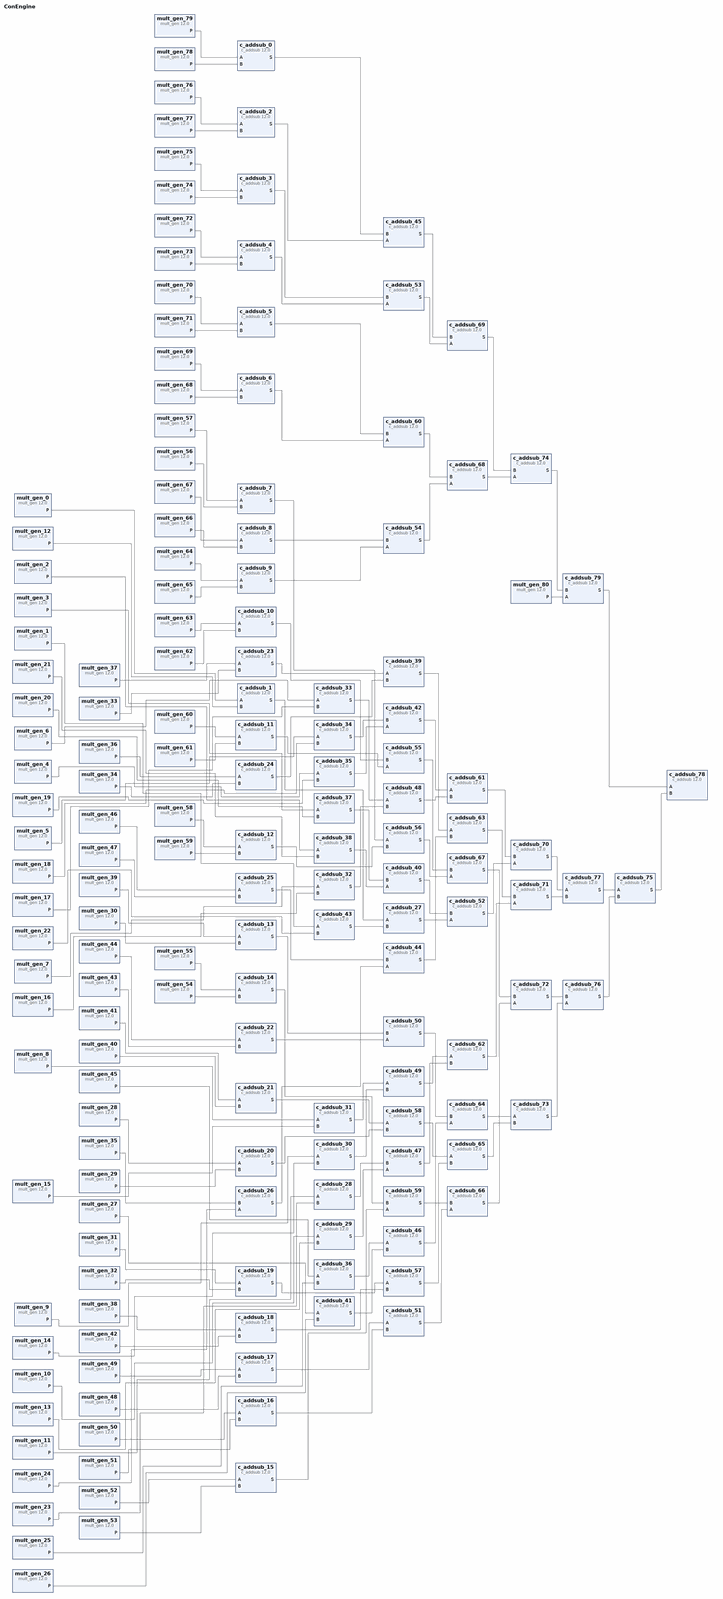
[diagram p0: block diagram of the top level, whole]
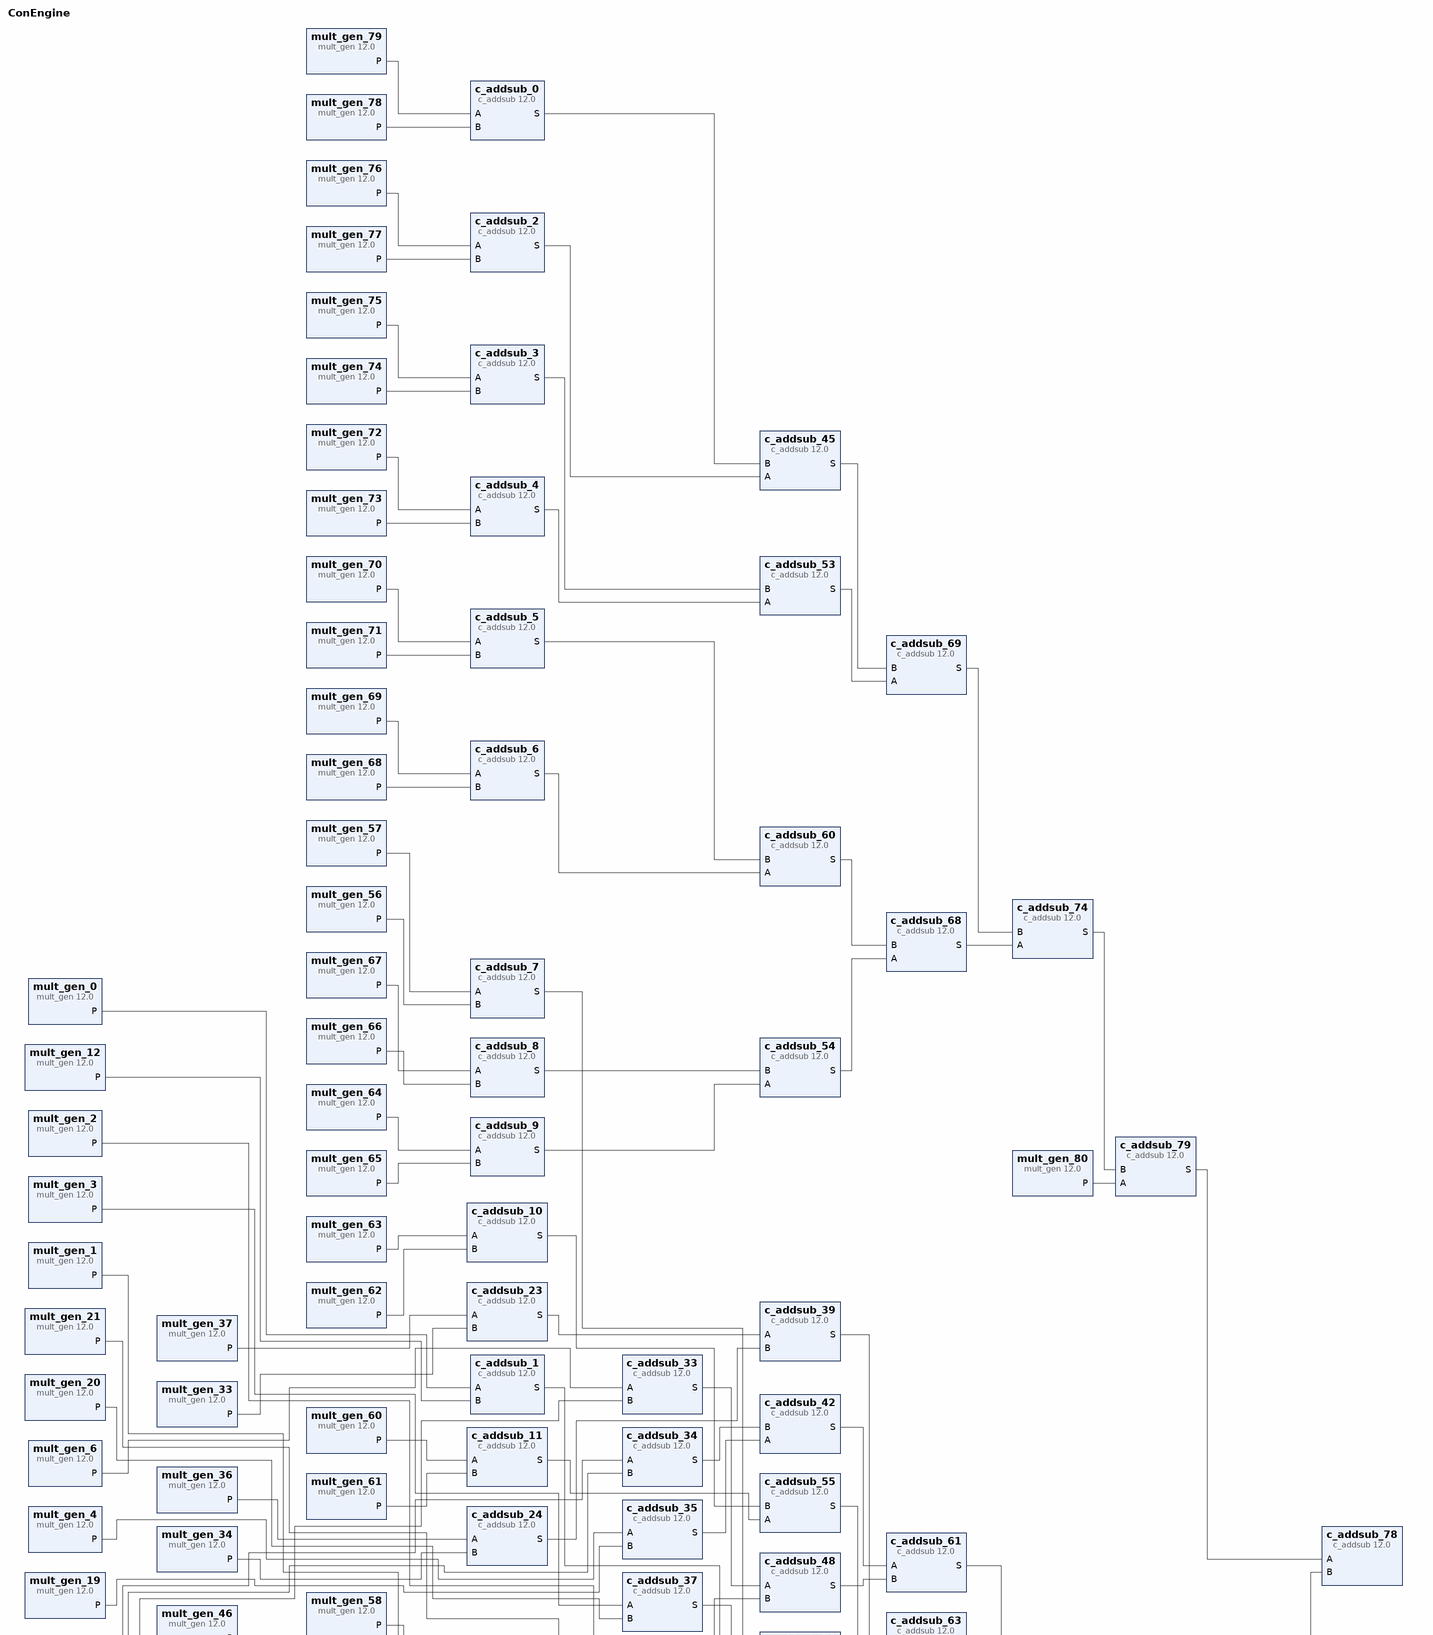
[diagram p1: block diagram of the top level, upper part]
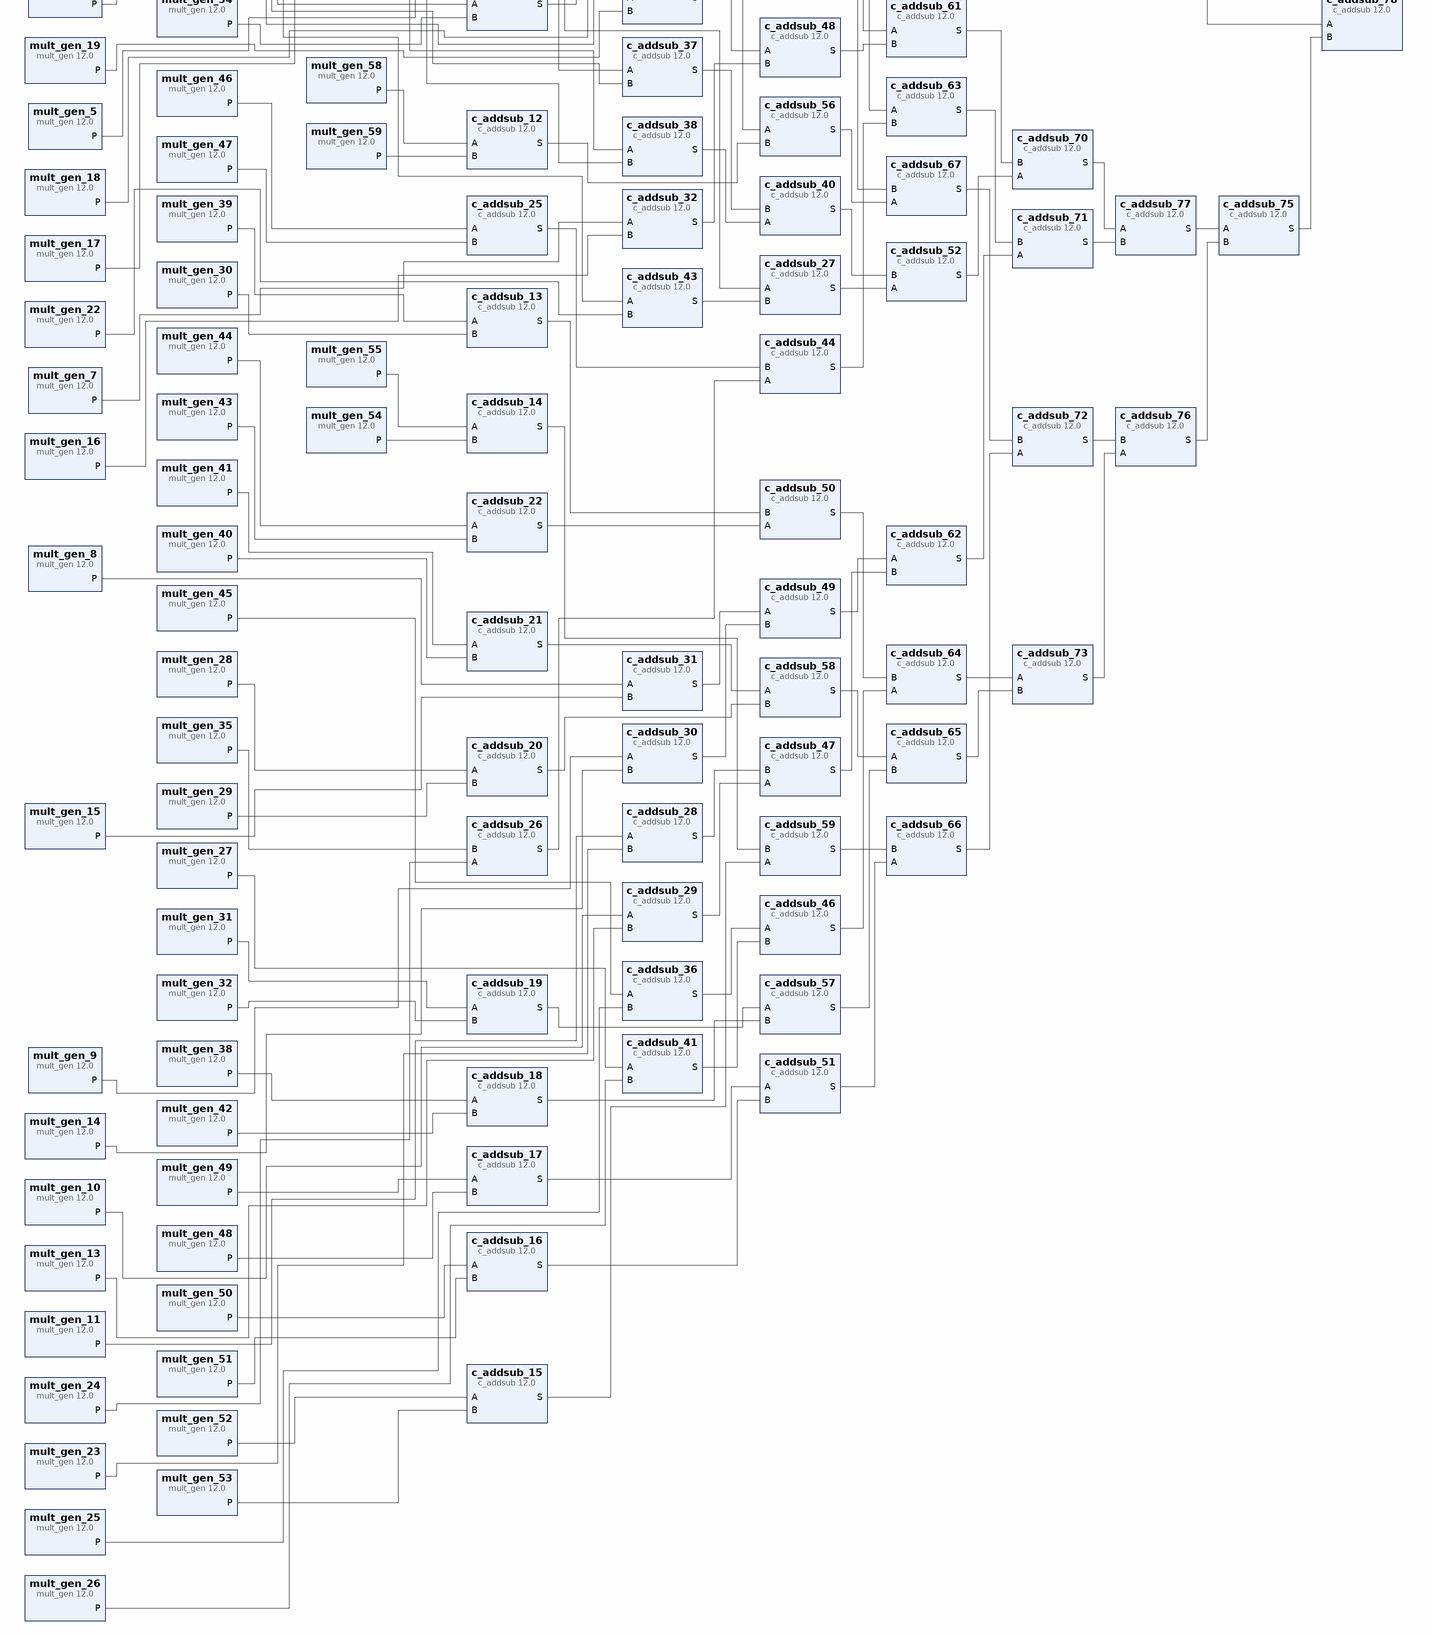
[diagram p2: block diagram of the top level, lower part]
# Vivado block design ConEngine, Vivado 2016.2
create_bd_design ConEngine

create_bd_cell -type ip -vlnv xilinx.com:ip:mult_gen:12.0 mult_gen_0
set_property -dict {CONFIG.PortAWidth 8 CONFIG.PortBWidth 8 CONFIG.Multiplier_Construction Use_Mults} [get_bd_cells mult_gen_0]
create_bd_cell -type ip -vlnv xilinx.com:ip:mult_gen:12.0 mult_gen_1
set_property -dict {CONFIG.PortAWidth 8 CONFIG.PortBWidth 8 CONFIG.Multiplier_Construction Use_Mults} [get_bd_cells mult_gen_1]
create_bd_cell -type ip -vlnv xilinx.com:ip:mult_gen:12.0 mult_gen_2
set_property -dict {CONFIG.PortAWidth 8 CONFIG.PortBWidth 8 CONFIG.Multiplier_Construction Use_Mults} [get_bd_cells mult_gen_2]
create_bd_cell -type ip -vlnv xilinx.com:ip:mult_gen:12.0 mult_gen_3
set_property -dict {CONFIG.PortAWidth 8 CONFIG.PortBWidth 8 CONFIG.Multiplier_Construction Use_Mults} [get_bd_cells mult_gen_3]
create_bd_cell -type ip -vlnv xilinx.com:ip:mult_gen:12.0 mult_gen_4
set_property -dict {CONFIG.PortAWidth 8 CONFIG.PortBWidth 8 CONFIG.Multiplier_Construction Use_Mults} [get_bd_cells mult_gen_4]
create_bd_cell -type ip -vlnv xilinx.com:ip:mult_gen:12.0 mult_gen_5
set_property -dict {CONFIG.PortAWidth 8 CONFIG.PortBWidth 8 CONFIG.Multiplier_Construction Use_Mults} [get_bd_cells mult_gen_5]
create_bd_cell -type ip -vlnv xilinx.com:ip:mult_gen:12.0 mult_gen_6
set_property -dict {CONFIG.PortAWidth 8 CONFIG.PortBWidth 8 CONFIG.Multiplier_Construction Use_Mults} [get_bd_cells mult_gen_6]
create_bd_cell -type ip -vlnv xilinx.com:ip:mult_gen:12.0 mult_gen_7
set_property -dict {CONFIG.PortAWidth 8 CONFIG.PortBWidth 8 CONFIG.Multiplier_Construction Use_Mults} [get_bd_cells mult_gen_7]
create_bd_cell -type ip -vlnv xilinx.com:ip:mult_gen:12.0 mult_gen_8
set_property -dict {CONFIG.PortAWidth 8 CONFIG.PortBWidth 8 CONFIG.Multiplier_Construction Use_Mults} [get_bd_cells mult_gen_8]
create_bd_cell -type ip -vlnv xilinx.com:ip:mult_gen:12.0 mult_gen_9
set_property -dict {CONFIG.PortAWidth 8 CONFIG.PortBWidth 8 CONFIG.Multiplier_Construction Use_Mults} [get_bd_cells mult_gen_9]
create_bd_cell -type ip -vlnv xilinx.com:ip:mult_gen:12.0 mult_gen_10
set_property -dict {CONFIG.PortAWidth 8 CONFIG.PortBWidth 8 CONFIG.Multiplier_Construction Use_Mults} [get_bd_cells mult_gen_10]
create_bd_cell -type ip -vlnv xilinx.com:ip:mult_gen:12.0 mult_gen_11
set_property -dict {CONFIG.PortAWidth 8 CONFIG.PortBWidth 8 CONFIG.Multiplier_Construction Use_Mults} [get_bd_cells mult_gen_11]
create_bd_cell -type ip -vlnv xilinx.com:ip:mult_gen:12.0 mult_gen_12
set_property -dict {CONFIG.PortAWidth 8 CONFIG.PortBWidth 8 CONFIG.Multiplier_Construction Use_Mults} [get_bd_cells mult_gen_12]
create_bd_cell -type ip -vlnv xilinx.com:ip:mult_gen:12.0 mult_gen_13
set_property -dict {CONFIG.PortAWidth 8 CONFIG.PortBWidth 8 CONFIG.Multiplier_Construction Use_Mults} [get_bd_cells mult_gen_13]
create_bd_cell -type ip -vlnv xilinx.com:ip:mult_gen:12.0 mult_gen_14
set_property -dict {CONFIG.PortAWidth 8 CONFIG.PortBWidth 8 CONFIG.Multiplier_Construction Use_Mults} [get_bd_cells mult_gen_14]
create_bd_cell -type ip -vlnv xilinx.com:ip:mult_gen:12.0 mult_gen_15
set_property -dict {CONFIG.PortAWidth 8 CONFIG.PortBWidth 8 CONFIG.Multiplier_Construction Use_Mults} [get_bd_cells mult_gen_15]
create_bd_cell -type ip -vlnv xilinx.com:ip:mult_gen:12.0 mult_gen_16
set_property -dict {CONFIG.PortAWidth 8 CONFIG.PortBWidth 8 CONFIG.Multiplier_Construction Use_Mults} [get_bd_cells mult_gen_16]
create_bd_cell -type ip -vlnv xilinx.com:ip:mult_gen:12.0 mult_gen_17
set_property -dict {CONFIG.PortAWidth 8 CONFIG.PortBWidth 8 CONFIG.Multiplier_Construction Use_Mults} [get_bd_cells mult_gen_17]
create_bd_cell -type ip -vlnv xilinx.com:ip:mult_gen:12.0 mult_gen_18
set_property -dict {CONFIG.PortAWidth 8 CONFIG.PortBWidth 8 CONFIG.Multiplier_Construction Use_Mults} [get_bd_cells mult_gen_18]
create_bd_cell -type ip -vlnv xilinx.com:ip:mult_gen:12.0 mult_gen_19
set_property -dict {CONFIG.PortAWidth 8 CONFIG.PortBWidth 8 CONFIG.Multiplier_Construction Use_Mults} [get_bd_cells mult_gen_19]
create_bd_cell -type ip -vlnv xilinx.com:ip:mult_gen:12.0 mult_gen_20
set_property -dict {CONFIG.PortAWidth 8 CONFIG.PortBWidth 8 CONFIG.Multiplier_Construction Use_Mults} [get_bd_cells mult_gen_20]
create_bd_cell -type ip -vlnv xilinx.com:ip:mult_gen:12.0 mult_gen_21
set_property -dict {CONFIG.PortAWidth 8 CONFIG.PortBWidth 8 CONFIG.Multiplier_Construction Use_Mults} [get_bd_cells mult_gen_21]
create_bd_cell -type ip -vlnv xilinx.com:ip:mult_gen:12.0 mult_gen_22
set_property -dict {CONFIG.PortAWidth 8 CONFIG.PortBWidth 8 CONFIG.Multiplier_Construction Use_Mults} [get_bd_cells mult_gen_22]
create_bd_cell -type ip -vlnv xilinx.com:ip:mult_gen:12.0 mult_gen_23
set_property -dict {CONFIG.PortAWidth 8 CONFIG.PortBWidth 8 CONFIG.Multiplier_Construction Use_Mults} [get_bd_cells mult_gen_23]
create_bd_cell -type ip -vlnv xilinx.com:ip:mult_gen:12.0 mult_gen_24
set_property -dict {CONFIG.PortAWidth 8 CONFIG.PortBWidth 8 CONFIG.Multiplier_Construction Use_Mults} [get_bd_cells mult_gen_24]
create_bd_cell -type ip -vlnv xilinx.com:ip:mult_gen:12.0 mult_gen_25
set_property -dict {CONFIG.PortAWidth 8 CONFIG.PortBWidth 8 CONFIG.Multiplier_Construction Use_Mults} [get_bd_cells mult_gen_25]
create_bd_cell -type ip -vlnv xilinx.com:ip:mult_gen:12.0 mult_gen_26
set_property -dict {CONFIG.PortAWidth 8 CONFIG.PortBWidth 8 CONFIG.Multiplier_Construction Use_Mults} [get_bd_cells mult_gen_26]
create_bd_cell -type ip -vlnv xilinx.com:ip:mult_gen:12.0 mult_gen_27
set_property -dict {CONFIG.PortAWidth 8 CONFIG.PortBWidth 8 CONFIG.Multiplier_Construction Use_Mults} [get_bd_cells mult_gen_27]
create_bd_cell -type ip -vlnv xilinx.com:ip:mult_gen:12.0 mult_gen_28
set_property -dict {CONFIG.PortAWidth 8 CONFIG.PortBWidth 8 CONFIG.Multiplier_Construction Use_Mults} [get_bd_cells mult_gen_28]
create_bd_cell -type ip -vlnv xilinx.com:ip:mult_gen:12.0 mult_gen_29
set_property -dict {CONFIG.PortAWidth 8 CONFIG.PortBWidth 8 CONFIG.Multiplier_Construction Use_Mults} [get_bd_cells mult_gen_29]
create_bd_cell -type ip -vlnv xilinx.com:ip:mult_gen:12.0 mult_gen_30
set_property -dict {CONFIG.PortAWidth 8 CONFIG.PortBWidth 8 CONFIG.Multiplier_Construction Use_Mults} [get_bd_cells mult_gen_30]
create_bd_cell -type ip -vlnv xilinx.com:ip:mult_gen:12.0 mult_gen_31
set_property -dict {CONFIG.PortAWidth 8 CONFIG.PortBWidth 8 CONFIG.Multiplier_Construction Use_Mults} [get_bd_cells mult_gen_31]
create_bd_cell -type ip -vlnv xilinx.com:ip:mult_gen:12.0 mult_gen_32
set_property -dict {CONFIG.PortAWidth 8 CONFIG.PortBWidth 8 CONFIG.Multiplier_Construction Use_Mults} [get_bd_cells mult_gen_32]
create_bd_cell -type ip -vlnv xilinx.com:ip:mult_gen:12.0 mult_gen_33
set_property -dict {CONFIG.PortAWidth 8 CONFIG.PortBWidth 8 CONFIG.Multiplier_Construction Use_Mults} [get_bd_cells mult_gen_33]
create_bd_cell -type ip -vlnv xilinx.com:ip:mult_gen:12.0 mult_gen_34
set_property -dict {CONFIG.PortAWidth 8 CONFIG.PortBWidth 8 CONFIG.Multiplier_Construction Use_Mults} [get_bd_cells mult_gen_34]
create_bd_cell -type ip -vlnv xilinx.com:ip:mult_gen:12.0 mult_gen_35
set_property -dict {CONFIG.PortAWidth 8 CONFIG.PortBWidth 8 CONFIG.Multiplier_Construction Use_Mults} [get_bd_cells mult_gen_35]
create_bd_cell -type ip -vlnv xilinx.com:ip:mult_gen:12.0 mult_gen_36
set_property -dict {CONFIG.PortAWidth 8 CONFIG.PortBWidth 8 CONFIG.Multiplier_Construction Use_Mults} [get_bd_cells mult_gen_36]
create_bd_cell -type ip -vlnv xilinx.com:ip:mult_gen:12.0 mult_gen_37
set_property -dict {CONFIG.PortAWidth 8 CONFIG.PortBWidth 8 CONFIG.Multiplier_Construction Use_Mults} [get_bd_cells mult_gen_37]
create_bd_cell -type ip -vlnv xilinx.com:ip:mult_gen:12.0 mult_gen_38
set_property -dict {CONFIG.PortAWidth 8 CONFIG.PortBWidth 8 CONFIG.Multiplier_Construction Use_Mults} [get_bd_cells mult_gen_38]
create_bd_cell -type ip -vlnv xilinx.com:ip:mult_gen:12.0 mult_gen_39
set_property -dict {CONFIG.PortAWidth 8 CONFIG.PortBWidth 8 CONFIG.Multiplier_Construction Use_Mults} [get_bd_cells mult_gen_39]
create_bd_cell -type ip -vlnv xilinx.com:ip:mult_gen:12.0 mult_gen_40
set_property -dict {CONFIG.PortAWidth 8 CONFIG.PortBWidth 8 CONFIG.Multiplier_Construction Use_Mults} [get_bd_cells mult_gen_40]
create_bd_cell -type ip -vlnv xilinx.com:ip:mult_gen:12.0 mult_gen_41
set_property -dict {CONFIG.PortAWidth 8 CONFIG.PortBWidth 8 CONFIG.Multiplier_Construction Use_Mults} [get_bd_cells mult_gen_41]
create_bd_cell -type ip -vlnv xilinx.com:ip:mult_gen:12.0 mult_gen_42
set_property -dict {CONFIG.PortAWidth 8 CONFIG.PortBWidth 8 CONFIG.Multiplier_Construction Use_Mults} [get_bd_cells mult_gen_42]
create_bd_cell -type ip -vlnv xilinx.com:ip:mult_gen:12.0 mult_gen_43
set_property -dict {CONFIG.PortAWidth 8 CONFIG.PortBWidth 8 CONFIG.Multiplier_Construction Use_Mults} [get_bd_cells mult_gen_43]
create_bd_cell -type ip -vlnv xilinx.com:ip:mult_gen:12.0 mult_gen_44
set_property -dict {CONFIG.PortAWidth 8 CONFIG.PortBWidth 8 CONFIG.Multiplier_Construction Use_Mults} [get_bd_cells mult_gen_44]
create_bd_cell -type ip -vlnv xilinx.com:ip:mult_gen:12.0 mult_gen_45
set_property -dict {CONFIG.PortAWidth 8 CONFIG.PortBWidth 8 CONFIG.Multiplier_Construction Use_Mults} [get_bd_cells mult_gen_45]
create_bd_cell -type ip -vlnv xilinx.com:ip:mult_gen:12.0 mult_gen_46
set_property -dict {CONFIG.PortAWidth 8 CONFIG.PortBWidth 8 CONFIG.Multiplier_Construction Use_Mults} [get_bd_cells mult_gen_46]
create_bd_cell -type ip -vlnv xilinx.com:ip:mult_gen:12.0 mult_gen_47
set_property -dict {CONFIG.PortAWidth 8 CONFIG.PortBWidth 8 CONFIG.Multiplier_Construction Use_Mults} [get_bd_cells mult_gen_47]
create_bd_cell -type ip -vlnv xilinx.com:ip:mult_gen:12.0 mult_gen_48
set_property -dict {CONFIG.PortAWidth 8 CONFIG.PortBWidth 8 CONFIG.Multiplier_Construction Use_Mults} [get_bd_cells mult_gen_48]
create_bd_cell -type ip -vlnv xilinx.com:ip:mult_gen:12.0 mult_gen_49
set_property -dict {CONFIG.PortAWidth 8 CONFIG.PortBWidth 8 CONFIG.Multiplier_Construction Use_Mults} [get_bd_cells mult_gen_49]
create_bd_cell -type ip -vlnv xilinx.com:ip:mult_gen:12.0 mult_gen_50
set_property -dict {CONFIG.PortAWidth 8 CONFIG.PortBWidth 8 CONFIG.Multiplier_Construction Use_Mults} [get_bd_cells mult_gen_50]
create_bd_cell -type ip -vlnv xilinx.com:ip:mult_gen:12.0 mult_gen_51
set_property -dict {CONFIG.PortAWidth 8 CONFIG.PortBWidth 8 CONFIG.Multiplier_Construction Use_Mults} [get_bd_cells mult_gen_51]
create_bd_cell -type ip -vlnv xilinx.com:ip:mult_gen:12.0 mult_gen_52
set_property -dict {CONFIG.PortAWidth 8 CONFIG.PortBWidth 8 CONFIG.Multiplier_Construction Use_Mults} [get_bd_cells mult_gen_52]
create_bd_cell -type ip -vlnv xilinx.com:ip:mult_gen:12.0 mult_gen_53
set_property -dict {CONFIG.PortAWidth 8 CONFIG.PortBWidth 8 CONFIG.Multiplier_Construction Use_Mults} [get_bd_cells mult_gen_53]
create_bd_cell -type ip -vlnv xilinx.com:ip:mult_gen:12.0 mult_gen_54
set_property -dict {CONFIG.PortAWidth 8 CONFIG.PortBWidth 8 CONFIG.Multiplier_Construction Use_Mults} [get_bd_cells mult_gen_54]
create_bd_cell -type ip -vlnv xilinx.com:ip:mult_gen:12.0 mult_gen_55
set_property -dict {CONFIG.PortAWidth 8 CONFIG.PortBWidth 8 CONFIG.Multiplier_Construction Use_Mults} [get_bd_cells mult_gen_55]
create_bd_cell -type ip -vlnv xilinx.com:ip:mult_gen:12.0 mult_gen_56
set_property -dict {CONFIG.PortAWidth 8 CONFIG.PortBWidth 8 CONFIG.Multiplier_Construction Use_Mults} [get_bd_cells mult_gen_56]
create_bd_cell -type ip -vlnv xilinx.com:ip:mult_gen:12.0 mult_gen_57
set_property -dict {CONFIG.PortAWidth 8 CONFIG.PortBWidth 8 CONFIG.Multiplier_Construction Use_Mults} [get_bd_cells mult_gen_57]
create_bd_cell -type ip -vlnv xilinx.com:ip:mult_gen:12.0 mult_gen_58
set_property -dict {CONFIG.PortAWidth 8 CONFIG.PortBWidth 8 CONFIG.Multiplier_Construction Use_Mults} [get_bd_cells mult_gen_58]
create_bd_cell -type ip -vlnv xilinx.com:ip:mult_gen:12.0 mult_gen_59
set_property -dict {CONFIG.PortAWidth 8 CONFIG.PortBWidth 8 CONFIG.Multiplier_Construction Use_Mults} [get_bd_cells mult_gen_59]
create_bd_cell -type ip -vlnv xilinx.com:ip:mult_gen:12.0 mult_gen_60
set_property -dict {CONFIG.PortAWidth 8 CONFIG.PortBWidth 8 CONFIG.Multiplier_Construction Use_Mults} [get_bd_cells mult_gen_60]
create_bd_cell -type ip -vlnv xilinx.com:ip:mult_gen:12.0 mult_gen_61
set_property -dict {CONFIG.PortAWidth 8 CONFIG.PortBWidth 8 CONFIG.Multiplier_Construction Use_Mults} [get_bd_cells mult_gen_61]
create_bd_cell -type ip -vlnv xilinx.com:ip:mult_gen:12.0 mult_gen_62
set_property -dict {CONFIG.PortAWidth 8 CONFIG.PortBWidth 8 CONFIG.Multiplier_Construction Use_Mults} [get_bd_cells mult_gen_62]
create_bd_cell -type ip -vlnv xilinx.com:ip:mult_gen:12.0 mult_gen_63
set_property -dict {CONFIG.PortAWidth 8 CONFIG.PortBWidth 8 CONFIG.Multiplier_Construction Use_Mults} [get_bd_cells mult_gen_63]
create_bd_cell -type ip -vlnv xilinx.com:ip:mult_gen:12.0 mult_gen_64
set_property -dict {CONFIG.PortAWidth 8 CONFIG.PortBWidth 8 CONFIG.Multiplier_Construction Use_Mults} [get_bd_cells mult_gen_64]
create_bd_cell -type ip -vlnv xilinx.com:ip:mult_gen:12.0 mult_gen_65
set_property -dict {CONFIG.PortAWidth 8 CONFIG.PortBWidth 8 CONFIG.Multiplier_Construction Use_Mults} [get_bd_cells mult_gen_65]
create_bd_cell -type ip -vlnv xilinx.com:ip:mult_gen:12.0 mult_gen_66
set_property -dict {CONFIG.PortAWidth 8 CONFIG.PortBWidth 8 CONFIG.Multiplier_Construction Use_Mults} [get_bd_cells mult_gen_66]
create_bd_cell -type ip -vlnv xilinx.com:ip:mult_gen:12.0 mult_gen_67
set_property -dict {CONFIG.PortAWidth 8 CONFIG.PortBWidth 8 CONFIG.Multiplier_Construction Use_Mults} [get_bd_cells mult_gen_67]
create_bd_cell -type ip -vlnv xilinx.com:ip:mult_gen:12.0 mult_gen_68
set_property -dict {CONFIG.PortAWidth 8 CONFIG.PortBWidth 8 CONFIG.Multiplier_Construction Use_Mults} [get_bd_cells mult_gen_68]
create_bd_cell -type ip -vlnv xilinx.com:ip:mult_gen:12.0 mult_gen_69
set_property -dict {CONFIG.PortAWidth 8 CONFIG.PortBWidth 8 CONFIG.Multiplier_Construction Use_Mults} [get_bd_cells mult_gen_69]
create_bd_cell -type ip -vlnv xilinx.com:ip:mult_gen:12.0 mult_gen_70
set_property -dict {CONFIG.PortAWidth 8 CONFIG.PortBWidth 8 CONFIG.Multiplier_Construction Use_Mults} [get_bd_cells mult_gen_70]
create_bd_cell -type ip -vlnv xilinx.com:ip:mult_gen:12.0 mult_gen_71
set_property -dict {CONFIG.PortAWidth 8 CONFIG.PortBWidth 8 CONFIG.Multiplier_Construction Use_Mults} [get_bd_cells mult_gen_71]
create_bd_cell -type ip -vlnv xilinx.com:ip:mult_gen:12.0 mult_gen_72
set_property -dict {CONFIG.PortAWidth 8 CONFIG.PortBWidth 8 CONFIG.Multiplier_Construction Use_Mults} [get_bd_cells mult_gen_72]
create_bd_cell -type ip -vlnv xilinx.com:ip:mult_gen:12.0 mult_gen_73
set_property -dict {CONFIG.PortAWidth 8 CONFIG.PortBWidth 8 CONFIG.Multiplier_Construction Use_Mults} [get_bd_cells mult_gen_73]
create_bd_cell -type ip -vlnv xilinx.com:ip:mult_gen:12.0 mult_gen_74
set_property -dict {CONFIG.PortAWidth 8 CONFIG.PortBWidth 8 CONFIG.Multiplier_Construction Use_Mults} [get_bd_cells mult_gen_74]
create_bd_cell -type ip -vlnv xilinx.com:ip:mult_gen:12.0 mult_gen_75
set_property -dict {CONFIG.PortAWidth 8 CONFIG.PortBWidth 8 CONFIG.Multiplier_Construction Use_Mults} [get_bd_cells mult_gen_75]
create_bd_cell -type ip -vlnv xilinx.com:ip:mult_gen:12.0 mult_gen_76
set_property -dict {CONFIG.PortAWidth 8 CONFIG.PortBWidth 8 CONFIG.Multiplier_Construction Use_Mults} [get_bd_cells mult_gen_76]
create_bd_cell -type ip -vlnv xilinx.com:ip:mult_gen:12.0 mult_gen_77
set_property -dict {CONFIG.PortAWidth 8 CONFIG.PortBWidth 8 CONFIG.Multiplier_Construction Use_Mults} [get_bd_cells mult_gen_77]
create_bd_cell -type ip -vlnv xilinx.com:ip:mult_gen:12.0 mult_gen_78
set_property -dict {CONFIG.PortAWidth 8 CONFIG.PortBWidth 8 CONFIG.Multiplier_Construction Use_Mults} [get_bd_cells mult_gen_78]
create_bd_cell -type ip -vlnv xilinx.com:ip:mult_gen:12.0 mult_gen_79
set_property -dict {CONFIG.PortAWidth 8 CONFIG.PortBWidth 8 CONFIG.Multiplier_Construction Use_Mults} [get_bd_cells mult_gen_79]
create_bd_cell -type ip -vlnv xilinx.com:ip:mult_gen:12.0 mult_gen_80
set_property -dict {CONFIG.PortAWidth 8 CONFIG.PortBWidth 8 CONFIG.Multiplier_Construction Use_Mults} [get_bd_cells mult_gen_80]
create_bd_cell -type ip -vlnv xilinx.com:ip:c_addsub:12.0 c_addsub_0
set_property -dict [list \
  CONFIG.A_Width 16 \
  CONFIG.B_Width 16 \
  CONFIG.Out_Width 17 \
  CONFIG.Latency 1 \
  CONFIG.B_Value 0000000000000000 \
] [get_bd_cells c_addsub_0]
create_bd_cell -type ip -vlnv xilinx.com:ip:c_addsub:12.0 c_addsub_1
set_property -dict [list \
  CONFIG.A_Width 16 \
  CONFIG.B_Width 16 \
  CONFIG.Out_Width 17 \
  CONFIG.Latency 1 \
  CONFIG.B_Value 0000000000000000 \
] [get_bd_cells c_addsub_1]
create_bd_cell -type ip -vlnv xilinx.com:ip:c_addsub:12.0 c_addsub_2
set_property -dict [list \
  CONFIG.A_Type Unsigned \
  CONFIG.B_Type Unsigned \
  CONFIG.A_Width 16 \
  CONFIG.B_Width 16 \
  CONFIG.Out_Width 17 \
  CONFIG.Latency 1 \
  CONFIG.B_Value 0000000000000000 \
] [get_bd_cells c_addsub_2]
create_bd_cell -type ip -vlnv xilinx.com:ip:c_addsub:12.0 c_addsub_3
set_property -dict [list \
  CONFIG.A_Type Unsigned \
  CONFIG.B_Type Unsigned \
  CONFIG.A_Width 16 \
  CONFIG.B_Width 16 \
  CONFIG.Out_Width 17 \
  CONFIG.Latency 1 \
  CONFIG.B_Value 0000000000000000 \
] [get_bd_cells c_addsub_3]
create_bd_cell -type ip -vlnv xilinx.com:ip:c_addsub:12.0 c_addsub_4
set_property -dict [list \
  CONFIG.A_Type Unsigned \
  CONFIG.B_Type Unsigned \
  CONFIG.A_Width 16 \
  CONFIG.B_Width 16 \
  CONFIG.Out_Width 17 \
  CONFIG.Latency 1 \
  CONFIG.B_Value 0000000000000000 \
] [get_bd_cells c_addsub_4]
create_bd_cell -type ip -vlnv xilinx.com:ip:c_addsub:12.0 c_addsub_5
set_property -dict [list \
  CONFIG.A_Type Unsigned \
  CONFIG.B_Type Unsigned \
  CONFIG.A_Width 16 \
  CONFIG.B_Width 16 \
  CONFIG.Out_Width 17 \
  CONFIG.Latency 1 \
  CONFIG.B_Value 0000000000000000 \
] [get_bd_cells c_addsub_5]
create_bd_cell -type ip -vlnv xilinx.com:ip:c_addsub:12.0 c_addsub_6
set_property -dict [list \
  CONFIG.A_Type Unsigned \
  CONFIG.B_Type Unsigned \
  CONFIG.A_Width 16 \
  CONFIG.B_Width 16 \
  CONFIG.Out_Width 17 \
  CONFIG.Latency 1 \
  CONFIG.B_Value 0000000000000000 \
] [get_bd_cells c_addsub_6]
create_bd_cell -type ip -vlnv xilinx.com:ip:c_addsub:12.0 c_addsub_7
set_property -dict [list \
  CONFIG.A_Width 16 \
  CONFIG.B_Width 16 \
  CONFIG.Out_Width 17 \
  CONFIG.Latency 1 \
  CONFIG.B_Value 0000000000000000 \
] [get_bd_cells c_addsub_7]
create_bd_cell -type ip -vlnv xilinx.com:ip:c_addsub:12.0 c_addsub_8
set_property -dict [list \
  CONFIG.A_Type Unsigned \
  CONFIG.B_Type Unsigned \
  CONFIG.A_Width 16 \
  CONFIG.B_Width 16 \
  CONFIG.Out_Width 17 \
  CONFIG.Latency 1 \
  CONFIG.B_Value 0000000000000000 \
] [get_bd_cells c_addsub_8]
create_bd_cell -type ip -vlnv xilinx.com:ip:c_addsub:12.0 c_addsub_9
set_property -dict [list \
  CONFIG.A_Type Unsigned \
  CONFIG.B_Type Unsigned \
  CONFIG.A_Width 16 \
  CONFIG.B_Width 16 \
  CONFIG.Out_Width 17 \
  CONFIG.Latency 1 \
  CONFIG.B_Value 0000000000000000 \
] [get_bd_cells c_addsub_9]
create_bd_cell -type ip -vlnv xilinx.com:ip:c_addsub:12.0 c_addsub_10
set_property -dict [list \
  CONFIG.A_Type Unsigned \
  CONFIG.B_Type Unsigned \
  CONFIG.A_Width 16 \
  CONFIG.B_Width 16 \
  CONFIG.Out_Width 17 \
  CONFIG.Latency 1 \
  CONFIG.B_Value 0000000000000000 \
] [get_bd_cells c_addsub_10]
create_bd_cell -type ip -vlnv xilinx.com:ip:c_addsub:12.0 c_addsub_11
set_property -dict [list \
  CONFIG.A_Type Unsigned \
  CONFIG.B_Type Unsigned \
  CONFIG.A_Width 16 \
  CONFIG.B_Width 16 \
  CONFIG.Out_Width 17 \
  CONFIG.Latency 1 \
  CONFIG.B_Value 0000000000000000 \
] [get_bd_cells c_addsub_11]
create_bd_cell -type ip -vlnv xilinx.com:ip:c_addsub:12.0 c_addsub_12
set_property -dict [list \
  CONFIG.A_Width 16 \
  CONFIG.B_Width 16 \
  CONFIG.Out_Width 17 \
  CONFIG.Latency 1 \
  CONFIG.B_Value 0000000000000000 \
] [get_bd_cells c_addsub_12]
create_bd_cell -type ip -vlnv xilinx.com:ip:c_addsub:12.0 c_addsub_13
set_property -dict [list \
  CONFIG.A_Width 16 \
  CONFIG.B_Width 16 \
  CONFIG.Out_Width 16 \
  CONFIG.Latency 1 \
  CONFIG.B_Value 0000000000000000 \
] [get_bd_cells c_addsub_13]
create_bd_cell -type ip -vlnv xilinx.com:ip:c_addsub:12.0 c_addsub_14
set_property -dict [list \
  CONFIG.A_Width 16 \
  CONFIG.B_Width 16 \
  CONFIG.Out_Width 17 \
  CONFIG.Latency 1 \
  CONFIG.B_Value 0000000000000000 \
] [get_bd_cells c_addsub_14]
create_bd_cell -type ip -vlnv xilinx.com:ip:c_addsub:12.0 c_addsub_15
set_property -dict [list \
  CONFIG.A_Width 16 \
  CONFIG.B_Width 16 \
  CONFIG.Out_Width 17 \
  CONFIG.Latency 1 \
  CONFIG.B_Value 0000000000000000 \
] [get_bd_cells c_addsub_15]
create_bd_cell -type ip -vlnv xilinx.com:ip:c_addsub:12.0 c_addsub_16
set_property -dict [list \
  CONFIG.A_Width 16 \
  CONFIG.B_Width 16 \
  CONFIG.Out_Width 17 \
  CONFIG.Latency 1 \
  CONFIG.B_Value 0000000000000000 \
] [get_bd_cells c_addsub_16]
create_bd_cell -type ip -vlnv xilinx.com:ip:c_addsub:12.0 c_addsub_17
set_property -dict [list \
  CONFIG.A_Width 16 \
  CONFIG.B_Width 16 \
  CONFIG.Out_Width 17 \
  CONFIG.Latency 1 \
  CONFIG.B_Value 0000000000000000 \
] [get_bd_cells c_addsub_17]
create_bd_cell -type ip -vlnv xilinx.com:ip:c_addsub:12.0 c_addsub_18
set_property -dict [list \
  CONFIG.A_Width 16 \
  CONFIG.B_Width 16 \
  CONFIG.Out_Width 17 \
  CONFIG.Latency 1 \
  CONFIG.B_Value 0000000000000000 \
] [get_bd_cells c_addsub_18]
create_bd_cell -type ip -vlnv xilinx.com:ip:c_addsub:12.0 c_addsub_19
set_property -dict [list \
  CONFIG.A_Width 16 \
  CONFIG.B_Width 16 \
  CONFIG.Out_Width 17 \
  CONFIG.Latency 1 \
  CONFIG.B_Value 0000000000000000 \
] [get_bd_cells c_addsub_19]
create_bd_cell -type ip -vlnv xilinx.com:ip:c_addsub:12.0 c_addsub_20
set_property -dict [list \
  CONFIG.A_Width 16 \
  CONFIG.B_Width 16 \
  CONFIG.Out_Width 17 \
  CONFIG.Latency 1 \
  CONFIG.B_Value 0000000000000000 \
] [get_bd_cells c_addsub_20]
create_bd_cell -type ip -vlnv xilinx.com:ip:c_addsub:12.0 c_addsub_21
set_property -dict [list \
  CONFIG.A_Width 16 \
  CONFIG.B_Width 16 \
  CONFIG.Out_Width 17 \
  CONFIG.Latency 1 \
  CONFIG.B_Value 0000000000000000 \
] [get_bd_cells c_addsub_21]
create_bd_cell -type ip -vlnv xilinx.com:ip:c_addsub:12.0 c_addsub_22
set_property -dict [list \
  CONFIG.A_Width 16 \
  CONFIG.B_Width 16 \
  CONFIG.Out_Width 17 \
  CONFIG.Latency 1 \
  CONFIG.B_Value 0000000000000000 \
] [get_bd_cells c_addsub_22]
create_bd_cell -type ip -vlnv xilinx.com:ip:c_addsub:12.0 c_addsub_24
set_property -dict [list \
  CONFIG.A_Width 16 \
  CONFIG.B_Width 16 \
  CONFIG.Out_Width 17 \
  CONFIG.Latency 1 \
  CONFIG.B_Value 0000000000000000 \
] [get_bd_cells c_addsub_24]
create_bd_cell -type ip -vlnv xilinx.com:ip:c_addsub:12.0 c_addsub_25
set_property -dict [list \
  CONFIG.A_Width 16 \
  CONFIG.B_Width 16 \
  CONFIG.Out_Width 17 \
  CONFIG.Latency 1 \
  CONFIG.B_Value 0000000000000000 \
] [get_bd_cells c_addsub_25]
create_bd_cell -type ip -vlnv xilinx.com:ip:c_addsub:12.0 c_addsub_26
set_property -dict [list \
  CONFIG.A_Width 16 \
  CONFIG.B_Width 16 \
  CONFIG.Out_Width 17 \
  CONFIG.Latency 1 \
  CONFIG.B_Value 0000000000000000 \
] [get_bd_cells c_addsub_26]
create_bd_cell -type ip -vlnv xilinx.com:ip:c_addsub:12.0 c_addsub_27
set_property -dict [list \
  CONFIG.A_Width 17 \
  CONFIG.B_Width 17 \
  CONFIG.Out_Width 18 \
  CONFIG.Latency 1 \
  CONFIG.B_Value 00000000000000000 \
] [get_bd_cells c_addsub_27]
create_bd_cell -type ip -vlnv xilinx.com:ip:c_addsub:12.0 c_addsub_28
set_property -dict [list \
  CONFIG.A_Width 16 \
  CONFIG.B_Width 16 \
  CONFIG.Out_Width 17 \
  CONFIG.Latency 1 \
  CONFIG.B_Value 0000000000000000 \
] [get_bd_cells c_addsub_28]
create_bd_cell -type ip -vlnv xilinx.com:ip:c_addsub:12.0 c_addsub_29
set_property -dict [list \
  CONFIG.A_Width 16 \
  CONFIG.B_Width 16 \
  CONFIG.Out_Width 17 \
  CONFIG.Latency 1 \
  CONFIG.B_Value 0000000000000000 \
] [get_bd_cells c_addsub_29]
create_bd_cell -type ip -vlnv xilinx.com:ip:c_addsub:12.0 c_addsub_30
set_property -dict [list \
  CONFIG.A_Width 16 \
  CONFIG.B_Width 16 \
  CONFIG.Out_Width 17 \
  CONFIG.Latency 1 \
  CONFIG.B_Value 0000000000000000 \
] [get_bd_cells c_addsub_30]
create_bd_cell -type ip -vlnv xilinx.com:ip:c_addsub:12.0 c_addsub_31
set_property -dict [list \
  CONFIG.A_Width 16 \
  CONFIG.B_Width 16 \
  CONFIG.Out_Width 17 \
  CONFIG.Latency 1 \
  CONFIG.B_Value 0000000000000000 \
] [get_bd_cells c_addsub_31]
create_bd_cell -type ip -vlnv xilinx.com:ip:c_addsub:12.0 c_addsub_32
set_property -dict [list \
  CONFIG.A_Width 16 \
  CONFIG.B_Width 16 \
  CONFIG.Out_Width 17 \
  CONFIG.Latency 1 \
  CONFIG.B_Value 0000000000000000 \
] [get_bd_cells c_addsub_32]
create_bd_cell -type ip -vlnv xilinx.com:ip:c_addsub:12.0 c_addsub_33
set_property -dict [list \
  CONFIG.A_Width 16 \
  CONFIG.B_Width 16 \
  CONFIG.Out_Width 17 \
  CONFIG.Latency 1 \
  CONFIG.B_Value 0000000000000000 \
] [get_bd_cells c_addsub_33]
create_bd_cell -type ip -vlnv xilinx.com:ip:c_addsub:12.0 c_addsub_34
set_property -dict [list \
  CONFIG.A_Width 16 \
  CONFIG.B_Width 16 \
  CONFIG.Out_Width 17 \
  CONFIG.Latency 1 \
  CONFIG.B_Value 0000000000000000 \
] [get_bd_cells c_addsub_34]
create_bd_cell -type ip -vlnv xilinx.com:ip:c_addsub:12.0 c_addsub_35
set_property -dict [list \
  CONFIG.A_Width 16 \
  CONFIG.B_Width 16 \
  CONFIG.Out_Width 17 \
  CONFIG.Latency 1 \
  CONFIG.B_Value 0000000000000000 \
] [get_bd_cells c_addsub_35]
create_bd_cell -type ip -vlnv xilinx.com:ip:c_addsub:12.0 c_addsub_36
set_property -dict [list \
  CONFIG.A_Width 16 \
  CONFIG.B_Width 16 \
  CONFIG.Out_Width 17 \
  CONFIG.Latency 1 \
  CONFIG.B_Value 0000000000000000 \
] [get_bd_cells c_addsub_36]
create_bd_cell -type ip -vlnv xilinx.com:ip:c_addsub:12.0 c_addsub_37
set_property -dict [list \
  CONFIG.A_Width 16 \
  CONFIG.B_Width 16 \
  CONFIG.Out_Width 17 \
  CONFIG.Latency 1 \
  CONFIG.B_Value 0000000000000000 \
] [get_bd_cells c_addsub_37]
create_bd_cell -type ip -vlnv xilinx.com:ip:c_addsub:12.0 c_addsub_38
set_property -dict [list \
  CONFIG.A_Width 16 \
  CONFIG.B_Width 16 \
  CONFIG.Out_Width 17 \
  CONFIG.Latency 1 \
  CONFIG.B_Value 0000000000000000 \
] [get_bd_cells c_addsub_38]
create_bd_cell -type ip -vlnv xilinx.com:ip:c_addsub:12.0 c_addsub_41
set_property -dict [list \
  CONFIG.A_Width 16 \
  CONFIG.B_Width 16 \
  CONFIG.Out_Width 17 \
  CONFIG.Latency 1 \
  CONFIG.B_Value 0000000000000000 \
] [get_bd_cells c_addsub_41]
create_bd_cell -type ip -vlnv xilinx.com:ip:c_addsub:12.0 c_addsub_43
set_property -dict [list \
  CONFIG.A_Width 16 \
  CONFIG.B_Width 16 \
  CONFIG.Out_Width 17 \
  CONFIG.Latency 1 \
  CONFIG.B_Value 0000000000000000 \
] [get_bd_cells c_addsub_43]
create_bd_cell -type ip -vlnv xilinx.com:ip:c_addsub:12.0 c_addsub_23
set_property -dict [list \
  CONFIG.A_Width 16 \
  CONFIG.B_Width 16 \
  CONFIG.Out_Width 17 \
  CONFIG.Latency 1 \
  CONFIG.B_Value 0000000000000000 \
] [get_bd_cells c_addsub_23]
create_bd_cell -type ip -vlnv xilinx.com:ip:c_addsub:12.0 c_addsub_39
set_property -dict [list \
  CONFIG.A_Width 17 \
  CONFIG.B_Width 17 \
  CONFIG.Out_Width 18 \
  CONFIG.Latency 1 \
  CONFIG.B_Value 00000000000000000 \
] [get_bd_cells c_addsub_39]
create_bd_cell -type ip -vlnv xilinx.com:ip:c_addsub:12.0 c_addsub_40
set_property -dict [list \
  CONFIG.A_Width 17 \
  CONFIG.B_Width 17 \
  CONFIG.Out_Width 18 \
  CONFIG.Latency 1 \
  CONFIG.B_Value 00000000000000000 \
] [get_bd_cells c_addsub_40]
create_bd_cell -type ip -vlnv xilinx.com:ip:c_addsub:12.0 c_addsub_42
set_property -dict [list \
  CONFIG.A_Width 17 \
  CONFIG.B_Width 17 \
  CONFIG.Out_Width 18 \
  CONFIG.Latency 1 \
  CONFIG.B_Value 00000000000000000 \
] [get_bd_cells c_addsub_42]
create_bd_cell -type ip -vlnv xilinx.com:ip:c_addsub:12.0 c_addsub_44
set_property -dict [list \
  CONFIG.A_Width 17 \
  CONFIG.B_Width 17 \
  CONFIG.Out_Width 18 \
  CONFIG.Latency 1 \
  CONFIG.B_Value 00000000000000000 \
] [get_bd_cells c_addsub_44]
create_bd_cell -type ip -vlnv xilinx.com:ip:c_addsub:12.0 c_addsub_45
set_property -dict [list \
  CONFIG.A_Width 17 \
  CONFIG.B_Width 17 \
  CONFIG.Out_Width 18 \
  CONFIG.Latency 1 \
  CONFIG.B_Value 00000000000000000 \
] [get_bd_cells c_addsub_45]
create_bd_cell -type ip -vlnv xilinx.com:ip:c_addsub:12.0 c_addsub_46
set_property -dict [list \
  CONFIG.A_Width 17 \
  CONFIG.B_Width 17 \
  CONFIG.Out_Width 18 \
  CONFIG.Latency 1 \
  CONFIG.B_Value 00000000000000000 \
] [get_bd_cells c_addsub_46]
create_bd_cell -type ip -vlnv xilinx.com:ip:c_addsub:12.0 c_addsub_47
set_property -dict [list \
  CONFIG.A_Width 17 \
  CONFIG.B_Width 17 \
  CONFIG.Out_Width 18 \
  CONFIG.Latency 1 \
  CONFIG.B_Value 00000000000000000 \
] [get_bd_cells c_addsub_47]
create_bd_cell -type ip -vlnv xilinx.com:ip:c_addsub:12.0 c_addsub_48
set_property -dict [list \
  CONFIG.A_Width 17 \
  CONFIG.B_Width 17 \
  CONFIG.Out_Width 18 \
  CONFIG.Latency 1 \
  CONFIG.B_Value 00000000000000000 \
] [get_bd_cells c_addsub_48]
create_bd_cell -type ip -vlnv xilinx.com:ip:c_addsub:12.0 c_addsub_49
set_property -dict [list \
  CONFIG.A_Width 17 \
  CONFIG.B_Width 17 \
  CONFIG.Out_Width 18 \
  CONFIG.Latency 1 \
  CONFIG.B_Value 00000000000000000 \
] [get_bd_cells c_addsub_49]
create_bd_cell -type ip -vlnv xilinx.com:ip:c_addsub:12.0 c_addsub_50
set_property -dict [list \
  CONFIG.A_Width 17 \
  CONFIG.B_Width 17 \
  CONFIG.Out_Width 18 \
  CONFIG.Latency 1 \
  CONFIG.B_Value 00000000000000000 \
] [get_bd_cells c_addsub_50]
create_bd_cell -type ip -vlnv xilinx.com:ip:c_addsub:12.0 c_addsub_51
set_property -dict [list \
  CONFIG.A_Width 17 \
  CONFIG.B_Width 17 \
  CONFIG.Out_Width 18 \
  CONFIG.Latency 1 \
  CONFIG.B_Value 00000000000000000 \
] [get_bd_cells c_addsub_51]
create_bd_cell -type ip -vlnv xilinx.com:ip:c_addsub:12.0 c_addsub_53
set_property -dict [list \
  CONFIG.A_Width 17 \
  CONFIG.B_Width 17 \
  CONFIG.Out_Width 18 \
  CONFIG.Latency 1 \
  CONFIG.B_Value 00000000000000000 \
] [get_bd_cells c_addsub_53]
create_bd_cell -type ip -vlnv xilinx.com:ip:c_addsub:12.0 c_addsub_54
set_property -dict [list \
  CONFIG.A_Width 17 \
  CONFIG.B_Width 17 \
  CONFIG.Out_Width 18 \
  CONFIG.Latency 1 \
  CONFIG.B_Value 00000000000000000 \
] [get_bd_cells c_addsub_54]
create_bd_cell -type ip -vlnv xilinx.com:ip:c_addsub:12.0 c_addsub_55
set_property -dict [list \
  CONFIG.A_Width 17 \
  CONFIG.B_Width 17 \
  CONFIG.Out_Width 18 \
  CONFIG.Latency 1 \
  CONFIG.B_Value 00000000000000000 \
] [get_bd_cells c_addsub_55]
create_bd_cell -type ip -vlnv xilinx.com:ip:c_addsub:12.0 c_addsub_56
set_property -dict [list \
  CONFIG.A_Width 17 \
  CONFIG.B_Width 17 \
  CONFIG.Out_Width 18 \
  CONFIG.Latency 1 \
  CONFIG.B_Value 00000000000000000 \
] [get_bd_cells c_addsub_56]
create_bd_cell -type ip -vlnv xilinx.com:ip:c_addsub:12.0 c_addsub_57
set_property -dict [list \
  CONFIG.A_Width 17 \
  CONFIG.B_Width 17 \
  CONFIG.Out_Width 18 \
  CONFIG.Latency 1 \
  CONFIG.B_Value 00000000000000000 \
] [get_bd_cells c_addsub_57]
create_bd_cell -type ip -vlnv xilinx.com:ip:c_addsub:12.0 c_addsub_58
set_property -dict [list \
  CONFIG.A_Width 17 \
  CONFIG.B_Width 17 \
  CONFIG.Out_Width 18 \
  CONFIG.Latency 1 \
  CONFIG.B_Value 00000000000000000 \
] [get_bd_cells c_addsub_58]
create_bd_cell -type ip -vlnv xilinx.com:ip:c_addsub:12.0 c_addsub_59
set_property -dict [list \
  CONFIG.A_Width 17 \
  CONFIG.B_Width 17 \
  CONFIG.Out_Width 18 \
  CONFIG.Latency 1 \
  CONFIG.B_Value 00000000000000000 \
] [get_bd_cells c_addsub_59]
create_bd_cell -type ip -vlnv xilinx.com:ip:c_addsub:12.0 c_addsub_60
set_property -dict [list \
  CONFIG.A_Width 17 \
  CONFIG.B_Width 17 \
  CONFIG.Out_Width 18 \
  CONFIG.Latency 1 \
  CONFIG.B_Value 00000000000000000 \
] [get_bd_cells c_addsub_60]
create_bd_cell -type ip -vlnv xilinx.com:ip:c_addsub:12.0 c_addsub_52
set_property -dict [list \
  CONFIG.A_Width 18 \
  CONFIG.B_Width 18 \
  CONFIG.Out_Width 19 \
  CONFIG.Latency 1 \
  CONFIG.B_Value 000000000000000000 \
  CONFIG.CE true \
] [get_bd_cells c_addsub_52]
create_bd_cell -type ip -vlnv xilinx.com:ip:c_addsub:12.0 c_addsub_61
set_property -dict [list \
  CONFIG.A_Width 18 \
  CONFIG.B_Width 18 \
  CONFIG.Out_Width 19 \
  CONFIG.Latency 1 \
  CONFIG.B_Value 000000000000000000 \
  CONFIG.CE true \
] [get_bd_cells c_addsub_61]
create_bd_cell -type ip -vlnv xilinx.com:ip:c_addsub:12.0 c_addsub_62
set_property -dict [list \
  CONFIG.A_Width 18 \
  CONFIG.B_Width 18 \
  CONFIG.Out_Width 19 \
  CONFIG.Latency 1 \
  CONFIG.B_Value 000000000000000000 \
  CONFIG.CE true \
] [get_bd_cells c_addsub_62]
create_bd_cell -type ip -vlnv xilinx.com:ip:c_addsub:12.0 c_addsub_63
set_property -dict [list \
  CONFIG.A_Width 18 \
  CONFIG.B_Width 18 \
  CONFIG.Out_Width 19 \
  CONFIG.Latency 1 \
  CONFIG.B_Value 000000000000000000 \
  CONFIG.CE true \
] [get_bd_cells c_addsub_63]
create_bd_cell -type ip -vlnv xilinx.com:ip:c_addsub:12.0 c_addsub_64
set_property -dict [list \
  CONFIG.A_Width 18 \
  CONFIG.B_Width 18 \
  CONFIG.Out_Width 19 \
  CONFIG.Latency 1 \
  CONFIG.B_Value 000000000000000000 \
  CONFIG.CE true \
] [get_bd_cells c_addsub_64]
create_bd_cell -type ip -vlnv xilinx.com:ip:c_addsub:12.0 c_addsub_65
set_property -dict [list \
  CONFIG.A_Width 18 \
  CONFIG.B_Width 18 \
  CONFIG.Out_Width 19 \
  CONFIG.Latency 1 \
  CONFIG.B_Value 000000000000000000 \
  CONFIG.CE true \
] [get_bd_cells c_addsub_65]
create_bd_cell -type ip -vlnv xilinx.com:ip:c_addsub:12.0 c_addsub_66
set_property -dict [list \
  CONFIG.A_Width 18 \
  CONFIG.B_Width 18 \
  CONFIG.Out_Width 19 \
  CONFIG.Latency 1 \
  CONFIG.B_Value 000000000000000000 \
  CONFIG.CE true \
] [get_bd_cells c_addsub_66]
create_bd_cell -type ip -vlnv xilinx.com:ip:c_addsub:12.0 c_addsub_67
set_property -dict [list \
  CONFIG.A_Width 18 \
  CONFIG.B_Width 18 \
  CONFIG.Out_Width 19 \
  CONFIG.Latency 1 \
  CONFIG.B_Value 000000000000000000 \
  CONFIG.CE true \
] [get_bd_cells c_addsub_67]
create_bd_cell -type ip -vlnv xilinx.com:ip:c_addsub:12.0 c_addsub_68
set_property -dict [list \
  CONFIG.A_Width 18 \
  CONFIG.B_Width 18 \
  CONFIG.Out_Width 19 \
  CONFIG.Latency 1 \
  CONFIG.B_Value 000000000000000000 \
  CONFIG.CE true \
] [get_bd_cells c_addsub_68]
create_bd_cell -type ip -vlnv xilinx.com:ip:c_addsub:12.0 c_addsub_69
set_property -dict [list \
  CONFIG.A_Width 18 \
  CONFIG.B_Width 18 \
  CONFIG.Out_Width 19 \
  CONFIG.Latency 1 \
  CONFIG.B_Value 000000000000000000 \
  CONFIG.CE true \
] [get_bd_cells c_addsub_69]
create_bd_cell -type ip -vlnv xilinx.com:ip:c_addsub:12.0 c_addsub_70
set_property -dict [list \
  CONFIG.A_Width 19 \
  CONFIG.B_Width 19 \
  CONFIG.Out_Width 20 \
  CONFIG.Latency 1 \
  CONFIG.B_Value 0000000000000000000 \
  CONFIG.CE false \
] [get_bd_cells c_addsub_70]
create_bd_cell -type ip -vlnv xilinx.com:ip:c_addsub:12.0 c_addsub_71
set_property -dict [list \
  CONFIG.A_Width 19 \
  CONFIG.B_Width 19 \
  CONFIG.Out_Width 20 \
  CONFIG.Latency 1 \
  CONFIG.B_Value 0000000000000000000 \
  CONFIG.CE false \
] [get_bd_cells c_addsub_71]
create_bd_cell -type ip -vlnv xilinx.com:ip:c_addsub:12.0 c_addsub_72
set_property -dict [list \
  CONFIG.A_Width 19 \
  CONFIG.B_Width 19 \
  CONFIG.Out_Width 20 \
  CONFIG.Latency 1 \
  CONFIG.B_Value 0000000000000000000 \
  CONFIG.CE false \
] [get_bd_cells c_addsub_72]
create_bd_cell -type ip -vlnv xilinx.com:ip:c_addsub:12.0 c_addsub_73
set_property -dict [list \
  CONFIG.A_Width 19 \
  CONFIG.B_Width 19 \
  CONFIG.Out_Width 20 \
  CONFIG.Latency 1 \
  CONFIG.B_Value 0000000000000000000 \
  CONFIG.CE false \
] [get_bd_cells c_addsub_73]
create_bd_cell -type ip -vlnv xilinx.com:ip:c_addsub:12.0 c_addsub_74
set_property -dict [list \
  CONFIG.A_Width 19 \
  CONFIG.B_Width 19 \
  CONFIG.Out_Width 20 \
  CONFIG.Latency 1 \
  CONFIG.B_Value 0000000000000000000 \
  CONFIG.CE false \
] [get_bd_cells c_addsub_74]
create_bd_cell -type ip -vlnv xilinx.com:ip:c_addsub:12.0 c_addsub_75
set_property -dict [list \
  CONFIG.A_Width 21 \
  CONFIG.B_Width 21 \
  CONFIG.Out_Width 22 \
  CONFIG.Latency 1 \
  CONFIG.B_Value 000000000000000000000 \
  CONFIG.CE false \
] [get_bd_cells c_addsub_75]
create_bd_cell -type ip -vlnv xilinx.com:ip:c_addsub:12.0 c_addsub_76
set_property -dict [list \
  CONFIG.A_Width 20 \
  CONFIG.B_Width 20 \
  CONFIG.Out_Width 21 \
  CONFIG.Latency 1 \
  CONFIG.B_Value 00000000000000000000 \
  CONFIG.CE false \
] [get_bd_cells c_addsub_76]
create_bd_cell -type ip -vlnv xilinx.com:ip:c_addsub:12.0 c_addsub_77
set_property -dict [list \
  CONFIG.A_Width 20 \
  CONFIG.B_Width 20 \
  CONFIG.Out_Width 21 \
  CONFIG.Latency 1 \
  CONFIG.B_Value 00000000000000000000 \
  CONFIG.CE false \
] [get_bd_cells c_addsub_77]
create_bd_cell -type ip -vlnv xilinx.com:ip:c_addsub:12.0 c_addsub_78
set_property -dict [list \
  CONFIG.A_Width 21 \
  CONFIG.B_Width 22 \
  CONFIG.Out_Width 23 \
  CONFIG.Latency 1 \
  CONFIG.B_Value 0000000000000000000000 \
  CONFIG.CE false \
] [get_bd_cells c_addsub_78]
create_bd_cell -type ip -vlnv xilinx.com:ip:c_addsub:12.0 c_addsub_79
set_property -dict [list \
  CONFIG.A_Width 16 \
  CONFIG.B_Width 20 \
  CONFIG.Out_Width 21 \
  CONFIG.Latency 1 \
  CONFIG.B_Value 00000000000000000000 \
  CONFIG.CE false \
] [get_bd_cells c_addsub_79]

# ---- connections ----

connect_bd_net [get_bd_pins mult_gen_0/P] [get_bd_pins c_addsub_1/A]
connect_bd_net [get_bd_pins mult_gen_12/P] [get_bd_pins c_addsub_1/B]
connect_bd_net [get_bd_pins mult_gen_1/P] [get_bd_pins c_addsub_43/A]
connect_bd_net [get_bd_pins mult_gen_22/P] [get_bd_pins c_addsub_43/B]
connect_bd_net [get_bd_pins mult_gen_2/P] [get_bd_pins c_addsub_38/A]
connect_bd_net [get_bd_pins mult_gen_21/P] [get_bd_pins c_addsub_38/B]
connect_bd_net [get_bd_pins mult_gen_3/P] [get_bd_pins c_addsub_37/A]
connect_bd_net [get_bd_pins mult_gen_20/P] [get_bd_pins c_addsub_37/B]
connect_bd_net [get_bd_pins mult_gen_4/P] [get_bd_pins c_addsub_35/A]
connect_bd_net [get_bd_pins mult_gen_19/P] [get_bd_pins c_addsub_35/B]
connect_bd_net [get_bd_pins mult_gen_5/P] [get_bd_pins c_addsub_34/A]
connect_bd_net [get_bd_pins mult_gen_18/P] [get_bd_pins c_addsub_34/B]
connect_bd_net [get_bd_pins mult_gen_6/P] [get_bd_pins c_addsub_33/A]
connect_bd_net [get_bd_pins mult_gen_17/P] [get_bd_pins c_addsub_33/B]
connect_bd_net [get_bd_pins mult_gen_7/P] [get_bd_pins c_addsub_32/A]
connect_bd_net [get_bd_pins mult_gen_16/P] [get_bd_pins c_addsub_32/B]
connect_bd_net [get_bd_pins mult_gen_8/P] [get_bd_pins c_addsub_31/A]
connect_bd_net [get_bd_pins mult_gen_15/P] [get_bd_pins c_addsub_31/B]
connect_bd_net [get_bd_pins mult_gen_9/P] [get_bd_pins c_addsub_30/A]
connect_bd_net [get_bd_pins mult_gen_14/P] [get_bd_pins c_addsub_30/B]
connect_bd_net [get_bd_pins mult_gen_10/P] [get_bd_pins c_addsub_29/A]
connect_bd_net [get_bd_pins mult_gen_13/P] [get_bd_pins c_addsub_29/B]
connect_bd_net [get_bd_pins mult_gen_11/P] [get_bd_pins c_addsub_28/A]
connect_bd_net [get_bd_pins mult_gen_23/P] [get_bd_pins c_addsub_28/B]
connect_bd_net [get_bd_pins mult_gen_37/P] [get_bd_pins c_addsub_23/A]
connect_bd_net [get_bd_pins mult_gen_33/P] [get_bd_pins c_addsub_23/B]
connect_bd_net [get_bd_pins mult_gen_36/P] [get_bd_pins c_addsub_24/A]
connect_bd_net [get_bd_pins mult_gen_34/P] [get_bd_pins c_addsub_24/B]
connect_bd_net [get_bd_pins mult_gen_24/P] [get_bd_pins c_addsub_26/A]
connect_bd_net [get_bd_pins mult_gen_35/P] [get_bd_pins c_addsub_26/B]
connect_bd_net [get_bd_pins mult_gen_46/P] [get_bd_pins c_addsub_25/A]
connect_bd_net [get_bd_pins mult_gen_47/P] [get_bd_pins c_addsub_25/B]
connect_bd_net [get_bd_pins mult_gen_45/P] [get_bd_pins c_addsub_36/A]
connect_bd_net [get_bd_pins mult_gen_25/P] [get_bd_pins c_addsub_36/B]
connect_bd_net [get_bd_pins mult_gen_27/P] [get_bd_pins c_addsub_41/A]
connect_bd_net [get_bd_pins mult_gen_26/P] [get_bd_pins c_addsub_41/B]
connect_bd_net [get_bd_pins mult_gen_44/P] [get_bd_pins c_addsub_22/A]
connect_bd_net [get_bd_pins mult_gen_43/P] [get_bd_pins c_addsub_22/B]
connect_bd_net [get_bd_pins mult_gen_39/P] [get_bd_pins c_addsub_13/A]
connect_bd_net [get_bd_pins mult_gen_30/P] [get_bd_pins c_addsub_13/B]
connect_bd_net [get_bd_pins mult_gen_41/P] [get_bd_pins c_addsub_21/A]
connect_bd_net [get_bd_pins mult_gen_40/P] [get_bd_pins c_addsub_21/B]
connect_bd_net [get_bd_pins mult_gen_28/P] [get_bd_pins c_addsub_20/A]
connect_bd_net [get_bd_pins mult_gen_29/P] [get_bd_pins c_addsub_20/B]
connect_bd_net [get_bd_pins mult_gen_31/P] [get_bd_pins c_addsub_19/A]
connect_bd_net [get_bd_pins mult_gen_32/P] [get_bd_pins c_addsub_19/B]
connect_bd_net [get_bd_pins mult_gen_38/P] [get_bd_pins c_addsub_18/A]
connect_bd_net [get_bd_pins mult_gen_42/P] [get_bd_pins c_addsub_18/B]
connect_bd_net [get_bd_pins mult_gen_49/P] [get_bd_pins c_addsub_17/A]
connect_bd_net [get_bd_pins mult_gen_48/P] [get_bd_pins c_addsub_17/B]
connect_bd_net [get_bd_pins mult_gen_50/P] [get_bd_pins c_addsub_16/A]
connect_bd_net [get_bd_pins mult_gen_51/P] [get_bd_pins c_addsub_16/B]
connect_bd_net [get_bd_pins mult_gen_52/P] [get_bd_pins c_addsub_15/A]
connect_bd_net [get_bd_pins mult_gen_53/P] [get_bd_pins c_addsub_15/B]
connect_bd_net [get_bd_pins mult_gen_55/P] [get_bd_pins c_addsub_14/A]
connect_bd_net [get_bd_pins mult_gen_54/P] [get_bd_pins c_addsub_14/B]
connect_bd_net [get_bd_pins mult_gen_57/P] [get_bd_pins c_addsub_7/A]
connect_bd_net [get_bd_pins mult_gen_56/P] [get_bd_pins c_addsub_7/B]
connect_bd_net [get_bd_pins mult_gen_58/P] [get_bd_pins c_addsub_12/A]
connect_bd_net [get_bd_pins mult_gen_59/P] [get_bd_pins c_addsub_12/B]
connect_bd_net [get_bd_pins mult_gen_60/P] [get_bd_pins c_addsub_11/A]
connect_bd_net [get_bd_pins mult_gen_61/P] [get_bd_pins c_addsub_11/B]
connect_bd_net [get_bd_pins mult_gen_63/P] [get_bd_pins c_addsub_10/A]
connect_bd_net [get_bd_pins mult_gen_62/P] [get_bd_pins c_addsub_10/B]
connect_bd_net [get_bd_pins mult_gen_64/P] [get_bd_pins c_addsub_9/A]
connect_bd_net [get_bd_pins mult_gen_65/P] [get_bd_pins c_addsub_9/B]
connect_bd_net [get_bd_pins mult_gen_67/P] [get_bd_pins c_addsub_8/A]
connect_bd_net [get_bd_pins mult_gen_66/P] [get_bd_pins c_addsub_8/B]
connect_bd_net [get_bd_pins mult_gen_69/P] [get_bd_pins c_addsub_6/A]
connect_bd_net [get_bd_pins mult_gen_68/P] [get_bd_pins c_addsub_6/B]
connect_bd_net [get_bd_pins mult_gen_70/P] [get_bd_pins c_addsub_5/A]
connect_bd_net [get_bd_pins mult_gen_71/P] [get_bd_pins c_addsub_5/B]
connect_bd_net [get_bd_pins mult_gen_72/P] [get_bd_pins c_addsub_4/A]
connect_bd_net [get_bd_pins mult_gen_73/P] [get_bd_pins c_addsub_4/B]
connect_bd_net [get_bd_pins mult_gen_75/P] [get_bd_pins c_addsub_3/A]
connect_bd_net [get_bd_pins mult_gen_74/P] [get_bd_pins c_addsub_3/B]
connect_bd_net [get_bd_pins mult_gen_76/P] [get_bd_pins c_addsub_2/A]
connect_bd_net [get_bd_pins mult_gen_77/P] [get_bd_pins c_addsub_2/B]
connect_bd_net [get_bd_pins mult_gen_79/P] [get_bd_pins c_addsub_0/A]
connect_bd_net [get_bd_pins mult_gen_78/P] [get_bd_pins c_addsub_0/B]
connect_bd_net [get_bd_pins c_addsub_2/S] [get_bd_pins c_addsub_45/A]
connect_bd_net [get_bd_pins c_addsub_0/S] [get_bd_pins c_addsub_45/B]
connect_bd_net [get_bd_pins c_addsub_1/S] [get_bd_pins c_addsub_27/A]
connect_bd_net [get_bd_pins c_addsub_43/S] [get_bd_pins c_addsub_27/B]
connect_bd_net [get_bd_pins c_addsub_38/S] [get_bd_pins c_addsub_40/A]
connect_bd_net [get_bd_pins c_addsub_37/S] [get_bd_pins c_addsub_40/B]
connect_bd_net [get_bd_pins c_addsub_35/S] [get_bd_pins c_addsub_42/A]
connect_bd_net [get_bd_pins c_addsub_34/S] [get_bd_pins c_addsub_42/B]
connect_bd_net [get_bd_pins c_addsub_33/S] [get_bd_pins c_addsub_48/A]
connect_bd_net [get_bd_pins c_addsub_32/S] [get_bd_pins c_addsub_48/B]
connect_bd_net [get_bd_pins c_addsub_31/S] [get_bd_pins c_addsub_49/A]
connect_bd_net [get_bd_pins c_addsub_30/S] [get_bd_pins c_addsub_49/B]
connect_bd_net [get_bd_pins c_addsub_29/S] [get_bd_pins c_addsub_47/A]
connect_bd_net [get_bd_pins c_addsub_28/S] [get_bd_pins c_addsub_47/B]
connect_bd_net [get_bd_pins c_addsub_23/S] [get_bd_pins c_addsub_39/A]
connect_bd_net [get_bd_pins c_addsub_24/S] [get_bd_pins c_addsub_39/B]
connect_bd_net [get_bd_pins c_addsub_26/S] [get_bd_pins c_addsub_44/A]
connect_bd_net [get_bd_pins c_addsub_25/S] [get_bd_pins c_addsub_44/B]
connect_bd_net [get_bd_pins c_addsub_36/S] [get_bd_pins c_addsub_46/A]
connect_bd_net [get_bd_pins c_addsub_41/S] [get_bd_pins c_addsub_46/B]
connect_bd_net [get_bd_pins c_addsub_22/S] [get_bd_pins c_addsub_50/A]
connect_bd_net [get_bd_pins c_addsub_13/S] [get_bd_pins c_addsub_50/B]
connect_bd_net [get_bd_pins c_addsub_21/S] [get_bd_pins c_addsub_58/A]
connect_bd_net [get_bd_pins c_addsub_20/S] [get_bd_pins c_addsub_58/B]
connect_bd_net [get_bd_pins c_addsub_19/S] [get_bd_pins c_addsub_57/A]
connect_bd_net [get_bd_pins c_addsub_18/S] [get_bd_pins c_addsub_57/B]
connect_bd_net [get_bd_pins c_addsub_17/S] [get_bd_pins c_addsub_51/A]
connect_bd_net [get_bd_pins c_addsub_16/S] [get_bd_pins c_addsub_51/B]
connect_bd_net [get_bd_pins c_addsub_15/S] [get_bd_pins c_addsub_59/A]
connect_bd_net [get_bd_pins c_addsub_14/S] [get_bd_pins c_addsub_59/B]
connect_bd_net [get_bd_pins c_addsub_7/S] [get_bd_pins c_addsub_56/A]
connect_bd_net [get_bd_pins c_addsub_12/S] [get_bd_pins c_addsub_56/B]
connect_bd_net [get_bd_pins c_addsub_11/S] [get_bd_pins c_addsub_55/A]
connect_bd_net [get_bd_pins c_addsub_10/S] [get_bd_pins c_addsub_55/B]
connect_bd_net [get_bd_pins c_addsub_9/S] [get_bd_pins c_addsub_54/A]
connect_bd_net [get_bd_pins c_addsub_8/S] [get_bd_pins c_addsub_54/B]
connect_bd_net [get_bd_pins c_addsub_6/S] [get_bd_pins c_addsub_60/A]
connect_bd_net [get_bd_pins c_addsub_5/S] [get_bd_pins c_addsub_60/B]
connect_bd_net [get_bd_pins c_addsub_4/S] [get_bd_pins c_addsub_53/A]
connect_bd_net [get_bd_pins c_addsub_3/S] [get_bd_pins c_addsub_53/B]
connect_bd_net [get_bd_pins c_addsub_27/S] [get_bd_pins c_addsub_52/A]
connect_bd_net [get_bd_pins c_addsub_40/S] [get_bd_pins c_addsub_52/B]
connect_bd_net [get_bd_pins c_addsub_42/S] [get_bd_pins c_addsub_61/A]
connect_bd_net [get_bd_pins c_addsub_48/S] [get_bd_pins c_addsub_61/B]
connect_bd_net [get_bd_pins c_addsub_49/S] [get_bd_pins c_addsub_62/A]
connect_bd_net [get_bd_pins c_addsub_47/S] [get_bd_pins c_addsub_62/B]
connect_bd_net [get_bd_pins c_addsub_39/S] [get_bd_pins c_addsub_63/A]
connect_bd_net [get_bd_pins c_addsub_44/S] [get_bd_pins c_addsub_63/B]
connect_bd_net [get_bd_pins c_addsub_46/S] [get_bd_pins c_addsub_64/A]
connect_bd_net [get_bd_pins c_addsub_50/S] [get_bd_pins c_addsub_64/B]
connect_bd_net [get_bd_pins c_addsub_58/S] [get_bd_pins c_addsub_65/A]
connect_bd_net [get_bd_pins c_addsub_57/S] [get_bd_pins c_addsub_65/B]
connect_bd_net [get_bd_pins c_addsub_51/S] [get_bd_pins c_addsub_66/A]
connect_bd_net [get_bd_pins c_addsub_59/S] [get_bd_pins c_addsub_66/B]
connect_bd_net [get_bd_pins c_addsub_56/S] [get_bd_pins c_addsub_67/A]
connect_bd_net [get_bd_pins c_addsub_55/S] [get_bd_pins c_addsub_67/B]
connect_bd_net [get_bd_pins c_addsub_54/S] [get_bd_pins c_addsub_68/A]
connect_bd_net [get_bd_pins c_addsub_60/S] [get_bd_pins c_addsub_68/B]
connect_bd_net [get_bd_pins c_addsub_53/S] [get_bd_pins c_addsub_69/A]
connect_bd_net [get_bd_pins c_addsub_45/S] [get_bd_pins c_addsub_69/B]
connect_bd_net [get_bd_pins c_addsub_52/S] [get_bd_pins c_addsub_70/A]
connect_bd_net [get_bd_pins c_addsub_61/S] [get_bd_pins c_addsub_70/B]
connect_bd_net [get_bd_pins c_addsub_62/S] [get_bd_pins c_addsub_71/A]
connect_bd_net [get_bd_pins c_addsub_63/S] [get_bd_pins c_addsub_71/B]
connect_bd_net [get_bd_pins c_addsub_64/S] [get_bd_pins c_addsub_73/A]
connect_bd_net [get_bd_pins c_addsub_65/S] [get_bd_pins c_addsub_73/B]
connect_bd_net [get_bd_pins c_addsub_66/S] [get_bd_pins c_addsub_72/A]
connect_bd_net [get_bd_pins c_addsub_67/S] [get_bd_pins c_addsub_72/B]
connect_bd_net [get_bd_pins c_addsub_68/S] [get_bd_pins c_addsub_74/A]
connect_bd_net [get_bd_pins c_addsub_69/S] [get_bd_pins c_addsub_74/B]
connect_bd_net [get_bd_pins c_addsub_70/S] [get_bd_pins c_addsub_77/A]
connect_bd_net [get_bd_pins c_addsub_71/S] [get_bd_pins c_addsub_77/B]
connect_bd_net [get_bd_pins c_addsub_73/S] [get_bd_pins c_addsub_76/A]
connect_bd_net [get_bd_pins c_addsub_72/S] [get_bd_pins c_addsub_76/B]
connect_bd_net [get_bd_pins c_addsub_77/S] [get_bd_pins c_addsub_75/A]
connect_bd_net [get_bd_pins c_addsub_76/S] [get_bd_pins c_addsub_75/B]
connect_bd_net [get_bd_pins mult_gen_80/P] [get_bd_pins c_addsub_79/A]
connect_bd_net [get_bd_pins c_addsub_74/S] [get_bd_pins c_addsub_79/B]
connect_bd_net [get_bd_pins c_addsub_75/S] [get_bd_pins c_addsub_78/B]
connect_bd_net [get_bd_pins c_addsub_79/S] [get_bd_pins c_addsub_78/A]

validate_bd_design
save_bd_design
